# EAGLE design ProtoStick (EAGLE 5.10)
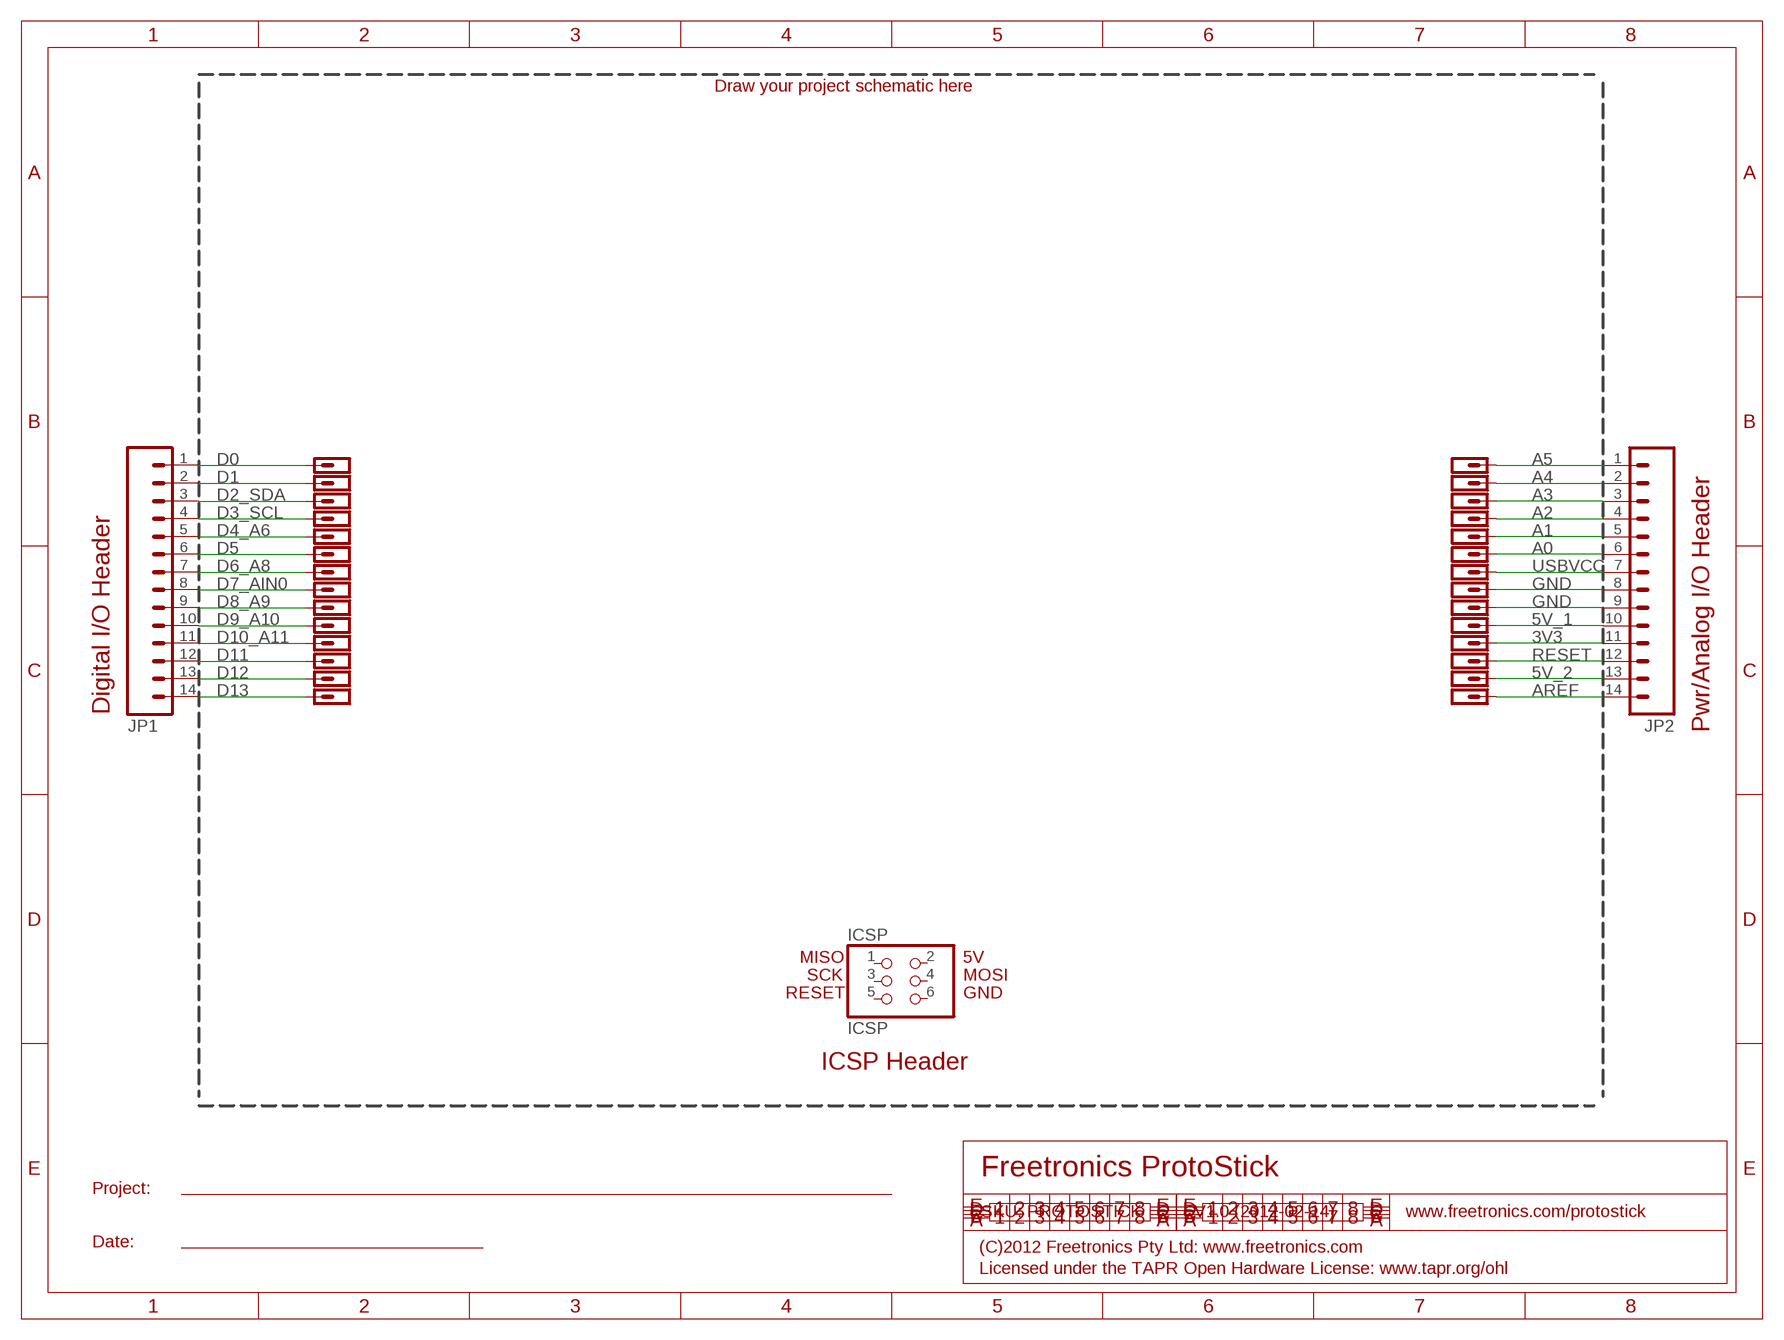
[diagram p0: schematic, sheet 1]

## Parts
ICSP  ICSP  PINHD-2X3  [2X03]
JP1  M14PADS_ONLY  [1X14_PADS_ONLY]
JP2  M14PADS_ONLY  [1X14_PADS_ONLY]
P1  PAD0.8MM  [PAD_1_0.8MM]
P2  PAD0.8MM  [PAD_1_0.8MM]
P3  PAD0.8MM  [PAD_1_0.8MM]
P4  PAD0.8MM  [PAD_1_0.8MM]
P5  PAD0.8MM  [PAD_1_0.8MM]
P6  PAD0.8MM  [PAD_1_0.8MM]
P7  PAD0.8MM  [PAD_1_0.8MM]
P8  PAD0.8MM  [PAD_1_0.8MM]
P9  PAD0.8MM  [PAD_1_0.8MM]
P10  PAD0.8MM  [PAD_1_0.8MM]
P11  PAD0.8MM  [PAD_1_0.8MM]
P12  PAD0.8MM  [PAD_1_0.8MM]
P13  PAD0.8MM  [PAD_1_0.8MM]
P14  PAD0.8MM  [PAD_1_0.8MM]
P15  PAD0.8MM  [PAD_1_0.8MM]
P16  PAD0.8MM  [PAD_1_0.8MM]
P17  PAD0.8MM  [PAD_1_0.8MM]
P18  PAD0.8MM  [PAD_1_0.8MM]
P19  PAD0.8MM  [PAD_1_0.8MM]
P20  PAD0.8MM  [PAD_1_0.8MM]
P21  PAD0.8MM  [PAD_1_0.8MM]
P22  PAD0.8MM  [PAD_1_0.8MM]
P23  PAD0.8MM  [PAD_1_0.8MM]
P24  PAD0.8MM  [PAD_1_0.8MM]
P25  PAD0.8MM  [PAD_1_0.8MM]
P26  PAD0.8MM  [PAD_1_0.8MM]
P27  PAD0.8MM  [PAD_1_0.8MM]
P28  PAD0.8MM  [PAD_1_0.8MM]

## Nets
3V3: JP2.11 P25.1
5V_1: JP2.10 P24.1
5V_2: JP2.13 P27.1
A0: JP2.6 P20.1
A1: JP2.5 P19.1
A2: JP2.4 P18.1
A3: JP2.3 P17.1
A4: JP2.2 P16.1
A5: JP2.1 P15.1
AREF: JP2.14 P28.1
D0: JP1.1 P1.1
D1: JP1.2 P2.1
D2_SDA: JP1.3 P3.1
D3_SCL: JP1.4 P4.1
D4_A6: JP1.5 P5.1
D5: JP1.6 P6.1
D6_A8: JP1.7 P7.1
D7_AIN0: JP1.8 P8.1
D8_A9: JP1.9 P9.1
D9_A10: JP1.10 P10.1
D10_A11: JP1.11 P11.1
D11: JP1.12 P12.1
D12: JP1.13 P13.1
D13: JP1.14 P14.1
GND: JP2.8 JP2.9 P22.1 P23.1
RESET: JP2.12 P26.1
USBVCC: JP2.7 P21.1
Unconnected: ICSP.1 ICSP.2 ICSP.3 ICSP.4 ICSP.5 ICSP.6

## Notes on the sheet
- Draw your project schematic here
- Digital I/O Header
- Pwr/Analog I/O Header
- MISO | 5V
- SCK | MOSI
- RESET | GND
- ICSP Header
- Freetronics ProtoStick
- Project:
- SKU: PROTOSTICK | V1.0 (2012-02-14) | www.freetronics.com/protostick
- Date:
- (C)2012 Freetronics Pty Ltd: www.freetronics.com
- Licensed under the TAPR Open Hardware License: www.tapr.org/ohl

## Library data of the parts
ICSP = pinhead:PINHD-2X3: PIN HEADER
JP1 JP2 = freetronics-master-v1:M14: Header 14 Standard 14-pin 0.1" header. Use with straight break away headers (SKU : PRT-00116), right angle break away headers (PRT-00553), swiss pins (PRT-00743), machine pins (PRT-00117), and female headers (PRT-00115).
P1-P28 = freetronics-master-v1:PAD

## Net classes
0 default: width 0.152 mm, drill 0.241 mm, clearance 0.152 mm

## Board
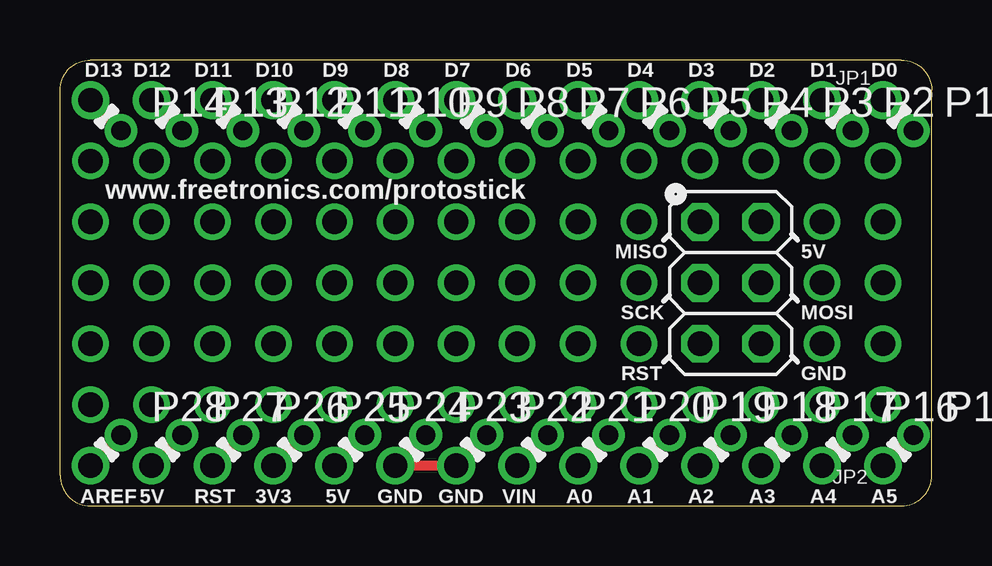
[diagram p1: board, top side]
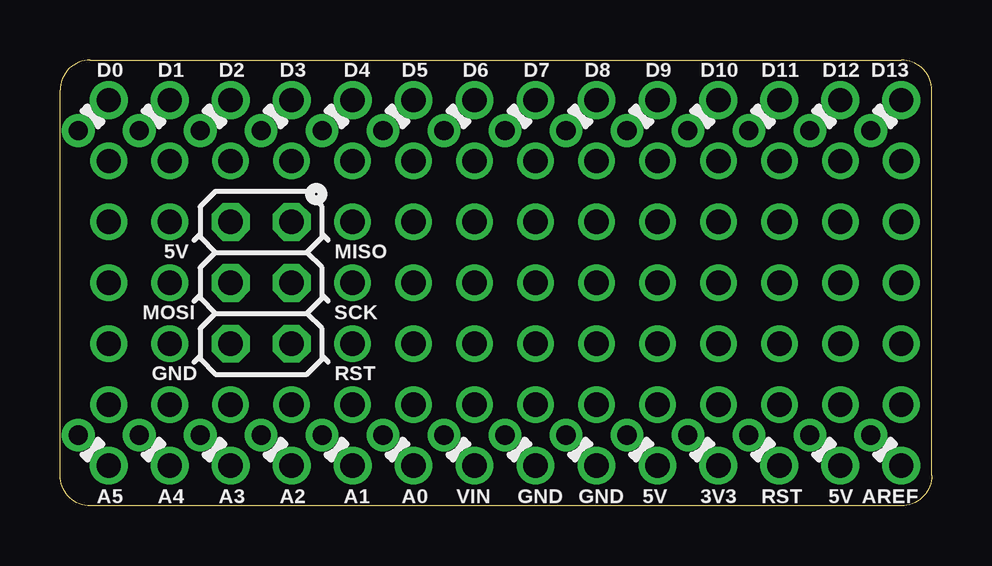
[diagram p2: board, bottom side, seen from below]

Size 36.32 x 18.59 mm. Coordinates in mm from the lower left corner, seen from the top.
Outline: 1.27,0 35.05,0 arc90 36.32,1.27 36.32,17.32 arc90 35.05,18.59 1.27,18.59 arc90 0,17.32 0,1.27 arc90 1.27,0
Copper layers (1*16): Top 0.035mm / dielectric 1.5mm / Bottom 0.035mm
Design rules "default *": minimum track width 6mil, minimum drill 9.5mil, track to track 8mil, track to pad 8mil, pad to pad 8mil, via to via 8mil, smd to smd 6mil, copper to edge 18mil, drill to drill 8mil, minimum pad ring 11mil, minimum via ring 4mil, stop-mask expansion 2mil, vias tented up to drill 25mil, thermal gap 10mil

### Footprints (pad centres in the part's own frame; a part is rotated, then mirrored left to right if it is on the bottom)
2X03 = drill 1.016 octagon: 1 -2.54,-1.27; 2 -2.54,1.27; 3 0,-1.27; 4 0,1.27; 5 2.54,-1.27; 6 2.54,1.27
1X14_PADS_ONLY = drill 1.016 round: 1 0,0; 2 2.54,0; 3 5.08,0; 4 7.62,0; 5 10.16,0; 6 12.7,0; 7 15.24,0; 8 17.78,0; 9 20.32,0; 10 22.86,0; 11 25.4,0; 12 27.94,0; 13 30.48,0; 14 33.02,0
PAD_1_0.8MM = drill 0.8 round: 1 0,0

### Placement (x,y rotation side)
ICSP  27.94,9.3 270 top
JP1  34.29,16.92 180 top
JP2  34.29,1.68 180 top
P1  35.56,15.65 0 top
P2  33.02,15.65 0 top
P3  30.48,15.65 0 top
P4  27.94,15.65 0 top
P5  25.4,15.65 0 top
P6  22.86,15.65 0 top
P7  20.32,15.65 0 top
P8  17.78,15.65 0 top
P9  15.24,15.65 0 top
P10  12.7,15.65 0 top
P11  10.16,15.65 0 top
P12  7.62,15.65 0 top
P13  5.08,15.65 0 top
P14  2.54,15.65 0 top
P15  35.56,2.95 0 top
P16  33.02,2.95 0 top
P17  30.48,2.95 0 top
P18  27.94,2.95 0 top
P19  25.4,2.95 0 top
P20  22.86,2.95 0 top
P21  20.32,2.95 0 top
P22  17.78,2.95 0 top
P23  15.24,2.95 0 top
P24  12.7,2.95 0 top
P25  10.16,2.95 0 top
P26  7.62,2.95 0 top
P27  5.08,2.95 0 top
P28  2.54,2.95 0 top

### Tracks (layer width: path | path; a pad name or v marks a point on that pad's centre or on a via)
3V3
  Top 0.406: JP2.11 P25.1
5V_1
  Top 0.406: JP2.10 P24.1
5V_2
  Top 0.406: JP2.13 P27.1
A0
  Top 0.406: JP2.6 P20.1
A1
  Top 0.406: JP2.5 P19.1
A2
  Top 0.406: JP2.4 P18.1
A3
  Top 0.406: JP2.3 P17.1
A4
  Top 0.406: JP2.2 P16.1
A5
  Top 0.406: JP2.1 P15.1
AREF
  Top 0.406: JP2.14 P28.1
D0
  Top 0.406: P1.1 JP1.1
D1
  Top 0.406: P2.1 JP1.2
D2_SDA
  Top 0.406: P3.1 JP1.3
D3_SCL
  Top 0.406: P4.1 JP1.4
D4_A6
  Top 0.406: P5.1 JP1.5
D5
  Top 0.406: P6.1 JP1.6
D6_A8
  Top 0.406: P7.1 JP1.7
D7_AIN0
  Top 0.406: P8.1 JP1.8
D8_A9
  Top 0.406: P9.1 JP1.9
D9_A10
  Top 0.406: P10.1 JP1.10
D10_A11
  Top 0.406: P11.1 JP1.11
D11
  Top 0.406: P12.1 JP1.12
D12
  Top 0.406: P13.1 JP1.13
D13
  Top 0.406: P14.1 JP1.14
GND
  Top 0.406: P23.1 JP2.9 JP2.8 P22.1
N$1  (via drill 1.02)
  other vias: 1.27,6.76
N$2  (via drill 1.02)
  other vias: 1.27,4.22
N$3  (via drill 1.02)
  other vias: 1.27,11.84
N$6  (via drill 1.02)
  other vias: 1.27,9.3
N$7  (via drill 1.02)
  other vias: 1.27,14.38
N$8  (via drill 1.02)
  other vias: 3.81,14.38
N$9  (via drill 1.02)
  other vias: 3.81,6.76
N$10  (via drill 1.02)
  other vias: 3.81,4.22
N$11  (via drill 1.02)
  other vias: 3.81,11.84
N$12  (via drill 1.02)
  other vias: 3.81,9.3
N$13  (via drill 1.02)
  other vias: 6.35,6.76
N$14  (via drill 1.02)
  other vias: 6.35,4.22
N$15  (via drill 1.02)
  other vias: 6.35,11.84
N$16  (via drill 1.02)
  other vias: 6.35,9.3
N$17  (via drill 1.02)
  other vias: 6.35,14.38
N$18  (via drill 1.02)
  other vias: 8.89,14.38
N$19  (via drill 1.02)
  other vias: 8.89,6.76
N$20  (via drill 1.02)
  other vias: 8.89,4.22
N$21  (via drill 1.02)
  other vias: 8.89,11.84
N$22  (via drill 1.02)
  other vias: 8.89,9.3
N$23  (via drill 1.02)
  other vias: 11.43,6.76
N$24  (via drill 1.02)
  other vias: 11.43,4.22
N$25  (via drill 1.02)
  other vias: 11.43,11.84
N$26  (via drill 1.02)
  other vias: 11.43,9.3
N$27  (via drill 1.02)
  other vias: 11.43,14.38
N$28  (via drill 1.02)
  other vias: 13.97,14.38
N$29  (via drill 1.02)
  other vias: 13.97,6.76
N$30  (via drill 1.02)
  other vias: 13.97,4.22
N$31  (via drill 1.02)
  other vias: 13.97,11.84
N$32  (via drill 1.02)
  other vias: 13.97,9.3
N$33  (via drill 1.02)
  other vias: 16.51,6.76
N$34  (via drill 1.02)
  other vias: 16.51,4.22
N$35  (via drill 1.02)
  other vias: 16.51,11.84
N$36  (via drill 1.02)
  other vias: 16.51,9.3
N$37  (via drill 1.02)
  other vias: 16.51,14.38
N$38  (via drill 1.02)
  other vias: 19.05,14.38
N$39  (via drill 1.02)
  other vias: 19.05,6.76
N$40  (via drill 1.02)
  other vias: 19.05,4.22
N$41  (via drill 1.02)
  other vias: 19.05,11.84
N$42  (via drill 1.02)
  other vias: 19.05,9.3
N$43  (via drill 1.02)
  other vias: 21.59,14.38
N$44  (via drill 1.02)
  other vias: 21.59,6.76
N$45  (via drill 1.02)
  other vias: 21.59,4.22
N$46  (via drill 1.02)
  other vias: 21.59,11.84
N$47  (via drill 1.02)
  other vias: 21.59,9.3
N$48  (via drill 1.02)
  other vias: 24.13,6.76
N$49  (via drill 1.02)
  other vias: 24.13,4.22
N$50  (via drill 1.02)
  other vias: 24.13,11.84
N$51  (via drill 1.02)
  other vias: 24.13,9.3
N$52  (via drill 1.02)
  other vias: 24.13,14.38
N$53  (via drill 1.02)
  other vias: 31.75,14.38
N$54  (via drill 1.02)
  other vias: 31.75,6.76
N$55  (via drill 1.02)
  other vias: 31.75,4.22
N$56  (via drill 1.02)
  other vias: 31.75,11.84
N$57  (via drill 1.02)
  other vias: 31.75,9.3
N$58  (via drill 1.02)
  other vias: 34.29,6.76
N$59  (via drill 1.02)
  other vias: 34.29,4.22
N$60  (via drill 1.02)
  other vias: 34.29,11.84
N$61  (via drill 1.02)
  other vias: 34.29,9.3
N$62  (via drill 1.02)
  other vias: 34.29,14.38
N$63  (via drill 1.02)
  other vias: 26.67,14.38
N$64  (via drill 1.02)
  other vias: 29.21,14.38
N$65  (via drill 1.02)
  other vias: 26.67,4.22
N$66  (via drill 1.02)
  other vias: 29.21,4.22
RESET
  Top 0.406: JP2.12 P26.1
USBVCC
  Top 0.406: JP2.7 P21.1

### Text on the board
tPlace: D13 | D12 | D11 | D10 | D9 | D8 | D7 | D6 | D5 | D4 | D3 | D2 | D1 | D0 | www.freetronics.com/protostick | MISO | 5V | SCK | MOSI | RST | GND | AREF | 5V | RST | 3V3 | 5V | GND | GND | VIN | A0 | A1 | A2 | A3 | A4 | A5
bPlace: D13 | D12 | D11 | D10 | D9 | D8 | D7 | D6 | D5 | D4 | D3 | D2 | D1 | D0 | MISO | 5V | SCK | MOSI | RST | GND | AREF | 5V | RST | 3V3 | 5V | GND | GND | VIN | A0 | A1 | A2 | A3 | A4 | A5